# Altium schematic sheet STM32.SchDoc
size 420 x 297 mm; DocumentNumber: STM32 FRONT 7"; SheetNumber: 5; SheetTotal: 6
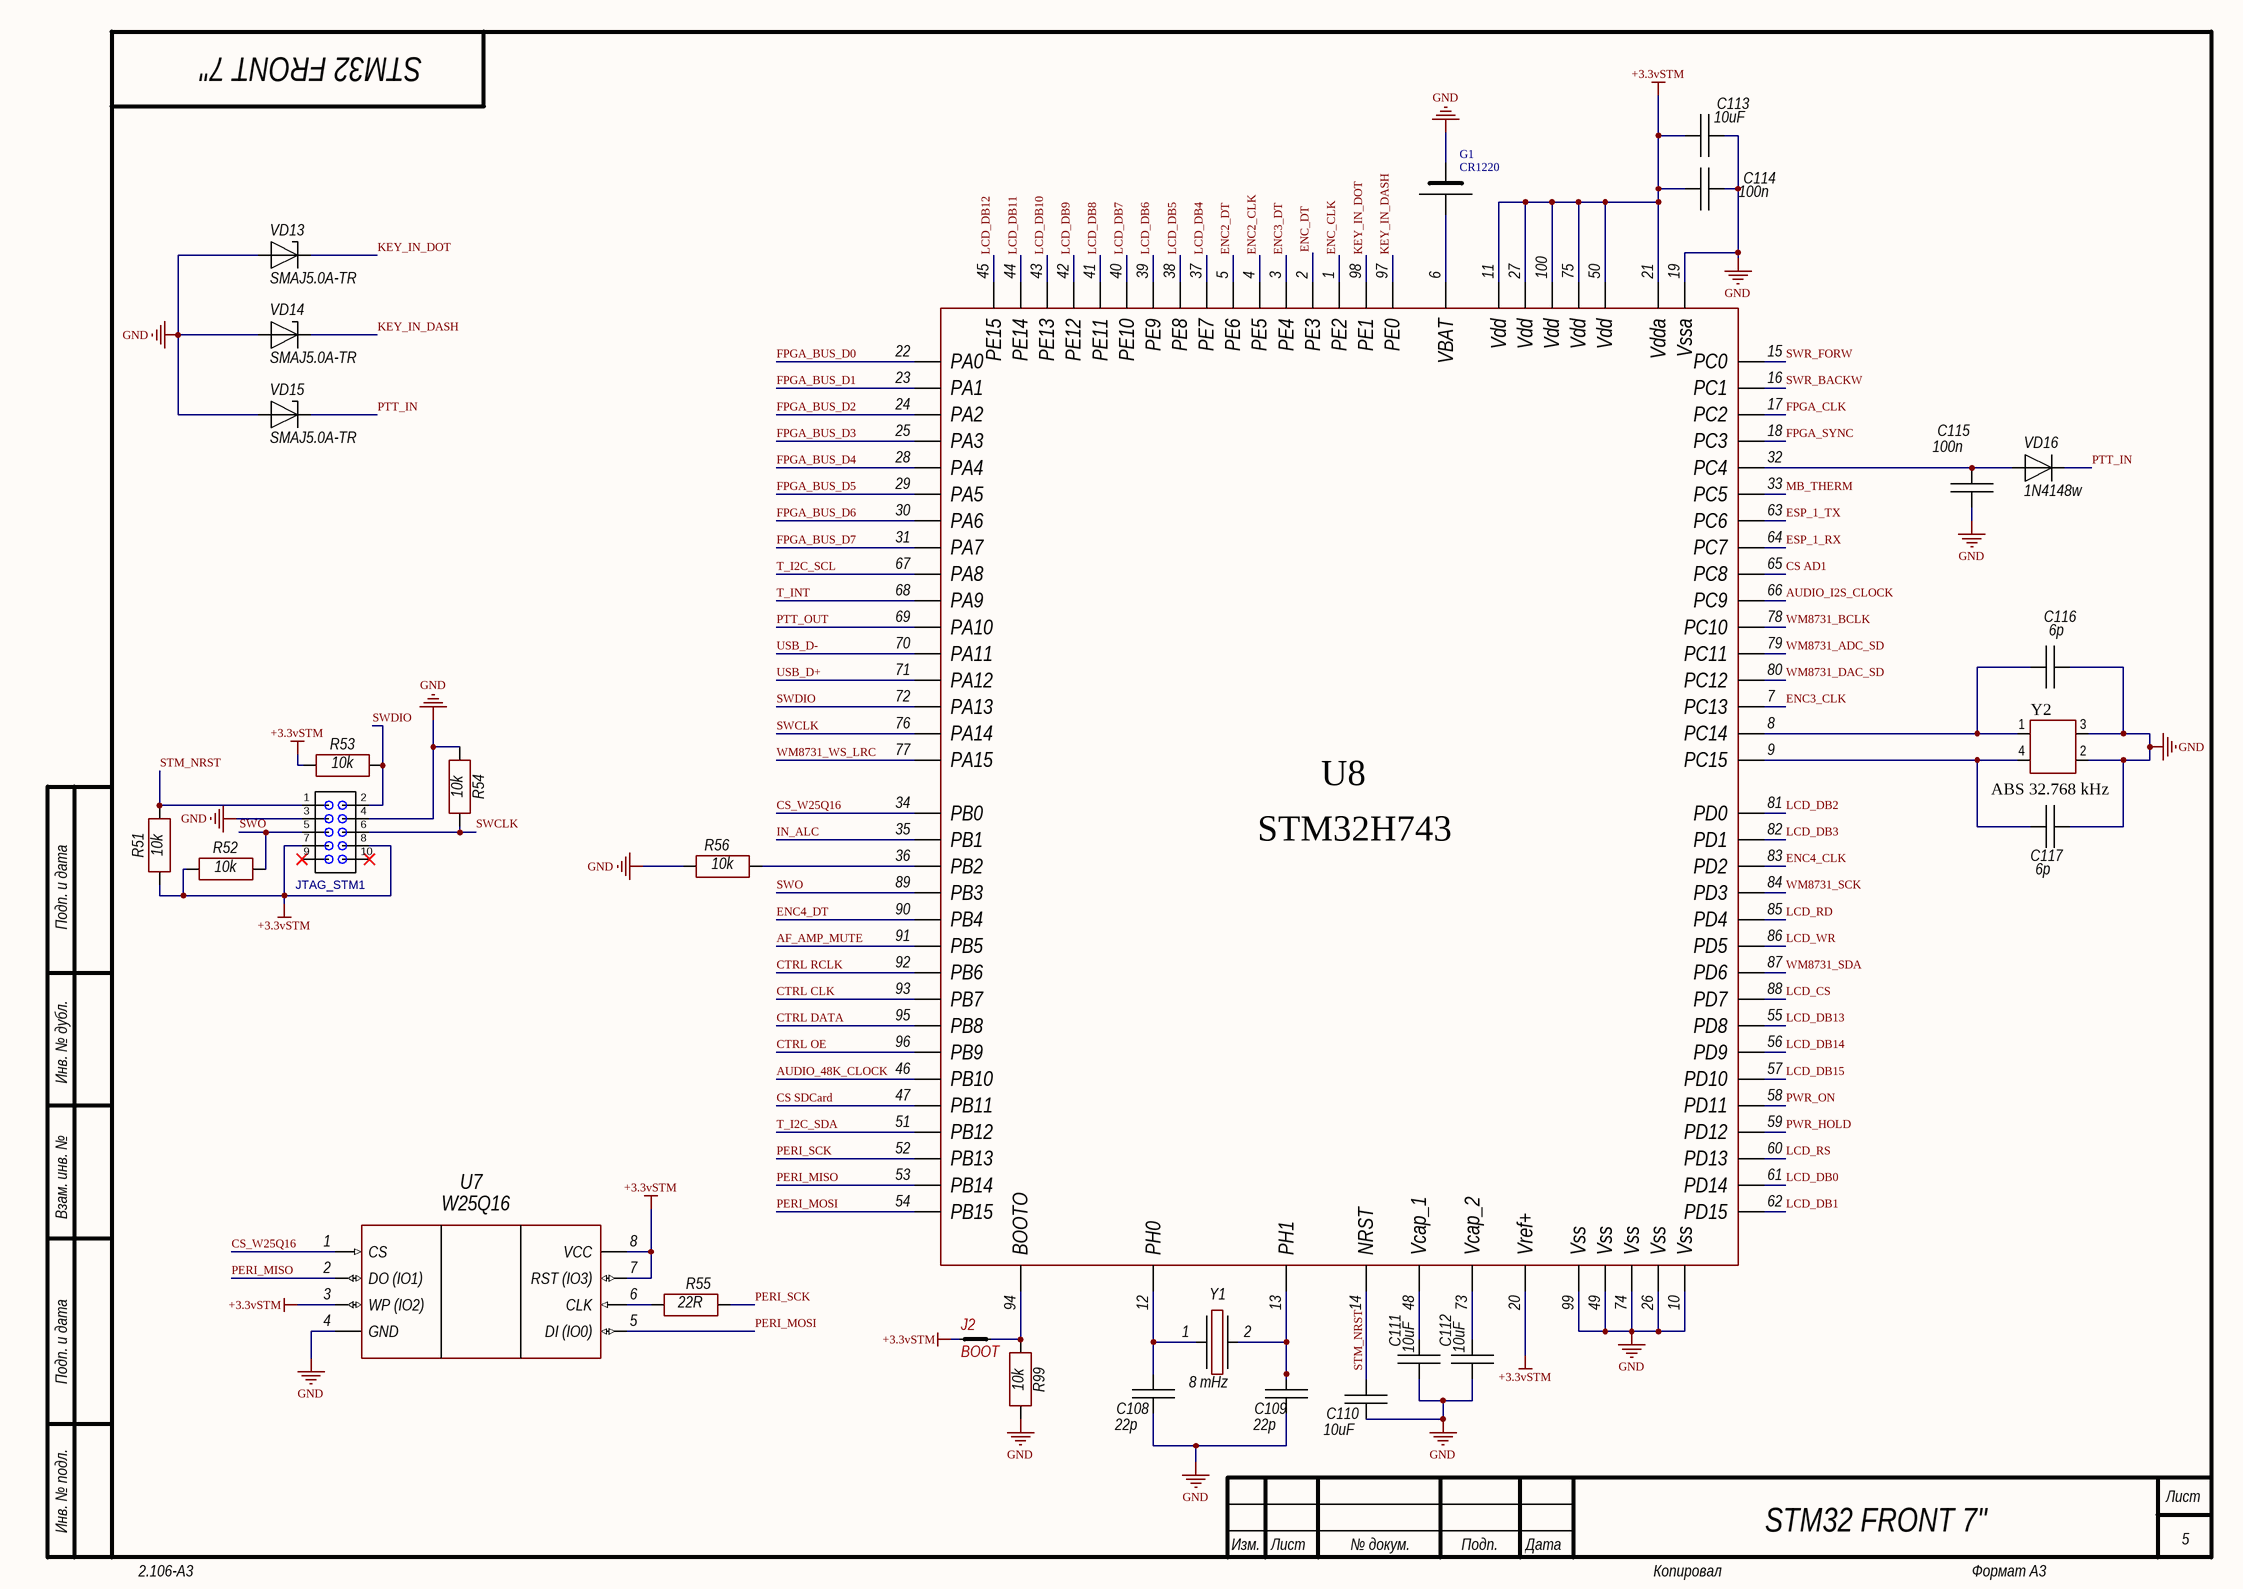
[diagram p0: STM32.SchDoc]

## Parts
C108  22p  [CH0805C]
C109  22p  [CH0805C]
C110  10uF  [CH0805C]
C111  10uF  [CH0805C]
C112  10uF  [CH0805C]
C113  10uF  [CH0805C]
C114  100n  [CH0805C]
C115  100n  [CH0805C]
C116  6p  [CH0805C]
C117  6p  [CH0805C]
G1  CR1220  [CR1220]
J2  BOOT  [CON: PLS-2]
JTAG_STM1  (no value)  [CON: BH-10]
R51  10k  [CH0805R]
R52  10k  [CH0805R]
R53  10k  [CH0805R]
R54  10k  [CH0805R]
R55  22R  [CH0805R]
R56  10k  [CH0805R]
R99  10k  [CH0805R]
U7  W25Q16  [8-SOIC-W]
U8  STM32H743  [100-LQFP]
VD13  SMAJ5.0A-TR  [SMA]
VD14  SMAJ5.0A-TR  [SMA]
VD15  SMAJ5.0A-TR  [SMA]
VD16  1N4148w  [SOD123]
Y1  8 mHz  [OSC-dip]
Y2  ABS 32.768 kHz  [ABS-25]

## Nets
+3.3vSTM: C113.1 C114.1 J2.1 JTAG_STM1.7 JTAG_STM1.8 R51.1 R52.1 R53.1 U7.3(WP_(IO2)) U7.7(RST_(IO3)) U7.8(VCC) U8.11(Vdd) U8.20(Vref+) U8.21(Vdda) U8.27(Vdd) U8.50(Vdd) U8.75(Vdd) U8.100(Vdd)
GND: C108.1 C109.1 C110.1 C111.1 C112.1 C113.2 C114.2 C115.1 C116.2 C117.2 G1.2 JTAG_STM1.3 JTAG_STM1.4 R54.2 R56.1 R99.1 U7.4(GND) U8.10(Vss) U8.19(Vssa) U8.26(Vss) U8.49(Vss) U8.74(Vss) U8.99(Vss) VD13.1(A) VD14.1(A) VD15.1(A) Y2.2 Y2.3
AF_AMP_MUTE: U8.91(PB5)
AUDIO_48K_CLOCK: U8.46(PB10)
AUDIO_I2S_CLOCK: U8.66(PC9)
CS AD1: U8.65(PC8)
CS SDCard: U8.47(PB11)
CS_W25Q16: U7.1(CS) U8.34(PB0)
CTRL CLK: U8.93(PB7)
CTRL DATA: U8.95(PB8)
CTRL OE: U8.96(PB9)
CTRL RCLK: U8.92(PB6)
ENC2_CLK: U8.4(PE5)
ENC2_DT: U8.5(PE6)
ENC3_CLK: U8.7(PC13)
ENC3_DT: U8.3(PE4)
ENC4_CLK: U8.83(PD2)
ENC4_DT: U8.90(PB4)
ENC_CLK: U8.1(PE2)
ENC_DT: U8.2(PE3)
ESP_1_RX: U8.64(PC7)
ESP_1_TX: U8.63(PC6)
FPGA_BUS_D0: U8.22(PA0)
FPGA_BUS_D1: U8.23(PA1)
FPGA_BUS_D2: U8.24(PA2)
FPGA_BUS_D3: U8.25(PA3)
FPGA_BUS_D4: U8.28(PA4)
FPGA_BUS_D5: U8.29(PA5)
FPGA_BUS_D6: U8.30(PA6)
FPGA_BUS_D7: U8.31(PA7)
FPGA_CLK: U8.17(PC2)
FPGA_SYNC: U8.18(PC3)
IN_ALC: U8.35(PB1)
KEY_IN_DASH: U8.97(PE0) VD14.2(C)
KEY_IN_DOT: U8.98(PE1) VD13.2(C)
LCD_CS: U8.88(PD7)
LCD_DB0: U8.61(PD14)
LCD_DB1: U8.62(PD15)
LCD_DB2: U8.81(PD0)
LCD_DB3: U8.82(PD1)
LCD_DB4: U8.37(PE7)
LCD_DB5: U8.38(PE8)
LCD_DB6: U8.39(PE9)
LCD_DB7: U8.40(PE10)
LCD_DB8: U8.41(PE11)
LCD_DB9: U8.42(PE12)
LCD_DB10: U8.43(PE13)
LCD_DB11: U8.44(PE14)
LCD_DB12: U8.45(PE15)
LCD_DB13: U8.55(PD8)
LCD_DB14: U8.56(PD9)
LCD_DB15: U8.57(PD10)
LCD_RD: U8.85(PD4)
LCD_RS: U8.60(PD13)
LCD_WR: U8.86(PD5)
MB_THERM: U8.33(PC5)
PERI_MISO: U7.2(DO_(IO1)) U8.53(PB14)
PERI_MOSI: U7.5(DI_(IO0)) U8.54(PB15)
PERI_SCK: R55.2 U8.52(PB13)
PTT_IN: VD15.2(C) VD16.2
PTT_OUT: U8.69(PA10)
PWR_HOLD: U8.59(PD12)
PWR_ON: U8.58(PD11)
STM_NRST: C110.2 JTAG_STM1.1 R51.2 U8.14(NRST)
SWCLK: JTAG_STM1.6 R54.1 U8.76(PA14)
SWDIO: JTAG_STM1.2 R53.2 U8.72(PA13)
SWO: JTAG_STM1.5 R52.2 U8.89(PB3)
SWR_BACKW: U8.16(PC1)
SWR_FORW: U8.15(PC0)
T_I2C_SCL: U8.67(PA8)
T_I2C_SDA: U8.51(PB12)
T_INT: U8.68(PA9)
USB_D+: U8.71(PA12)
USB_D-: U8.70(PA11)
WM8731_ADC_SD: U8.79(PC11)
WM8731_BCLK: U8.78(PC10)
WM8731_DAC_SD: U8.80(PC12)
WM8731_SCK: U8.84(PD3)
WM8731_SDA: U8.87(PD6)
WM8731_WS_LRC: U8.77(PA15)
NetC108_2: C108.2 U8.12(PH0) Y1.1
NetC109_2: C109.2 U8.13(PH1) Y1.2
NetC111_2: C111.2 U8.48(Vcap_1)
NetC112_2: C112.2 U8.73(Vcap_2)
NetC115_2: C115.2 U8.32(PC4) VD16.1
NetC116_1: C116.1 U8.8(PC14) Y2.1
NetC117_1: C117.1 U8.9(PC15) Y2.4
NetG1_1: G1.1 U8.6(VBAT)
NetJ2_2: J2.2 R99.2 U8.94(BOOTO)
NetR55_1: R55.1 U7.6(CLK)
NetR56_2: R56.2 U8.36(PB2)

Not connected (* = marked no-connect by the designer): JTAG_STM1 9* 10*

## Notes on the sheet
- Подп. и дата
- Инв. № дубл.
- Взам. инв. №
- Инв. № подл.
- Изм.
- Лист
- № докум.
- Подп.
- Дата
- 2.106-A3
- Копировал
- Формат А3

## Library data of the parts
C108-C117 = Capacitor: Manufacturer: *; Model: *; HelpURL: *; ComponentKind: *; Value: *
G1 = POWER_BAT
J2 = DJAMPER
JTAG_STM1 = IDC10: 2*5 Pin
R51-R56 R99 = Resistor: Manufacturer: *; Model: *; HelpURL: *; ComponentKind: *; Value: *
U7 = W25Q32JVZPIQ: Flash; Manufacturer: Winbond Electronics; Model: W25Q32JVZPIQ; HelpURL: https://www.digikey.com/product-detail/en/winbond-electronics/W25Q32JVZPIQ/W25Q32JVZPIQ-ND/6167525; ComponentKind: 8-WSON
VD13-VD15 = Diod Zener: ComponentKind: *; Manufacturer: *; Model: *; HelpURL: *
VD16 = Diod: ComponentKind: *; Manufacturer: *; Model: *; HelpURL: *
Y1 = Oscillator: Manufacturer: *; Model: *; HelpURL: *; ComponentKind: *; Value: *
Y2 = ABS25